# EAGLE design LB_BIT_1IN_3OUT-SMALL-v03(1_1x) (EAGLE 6.5.0)
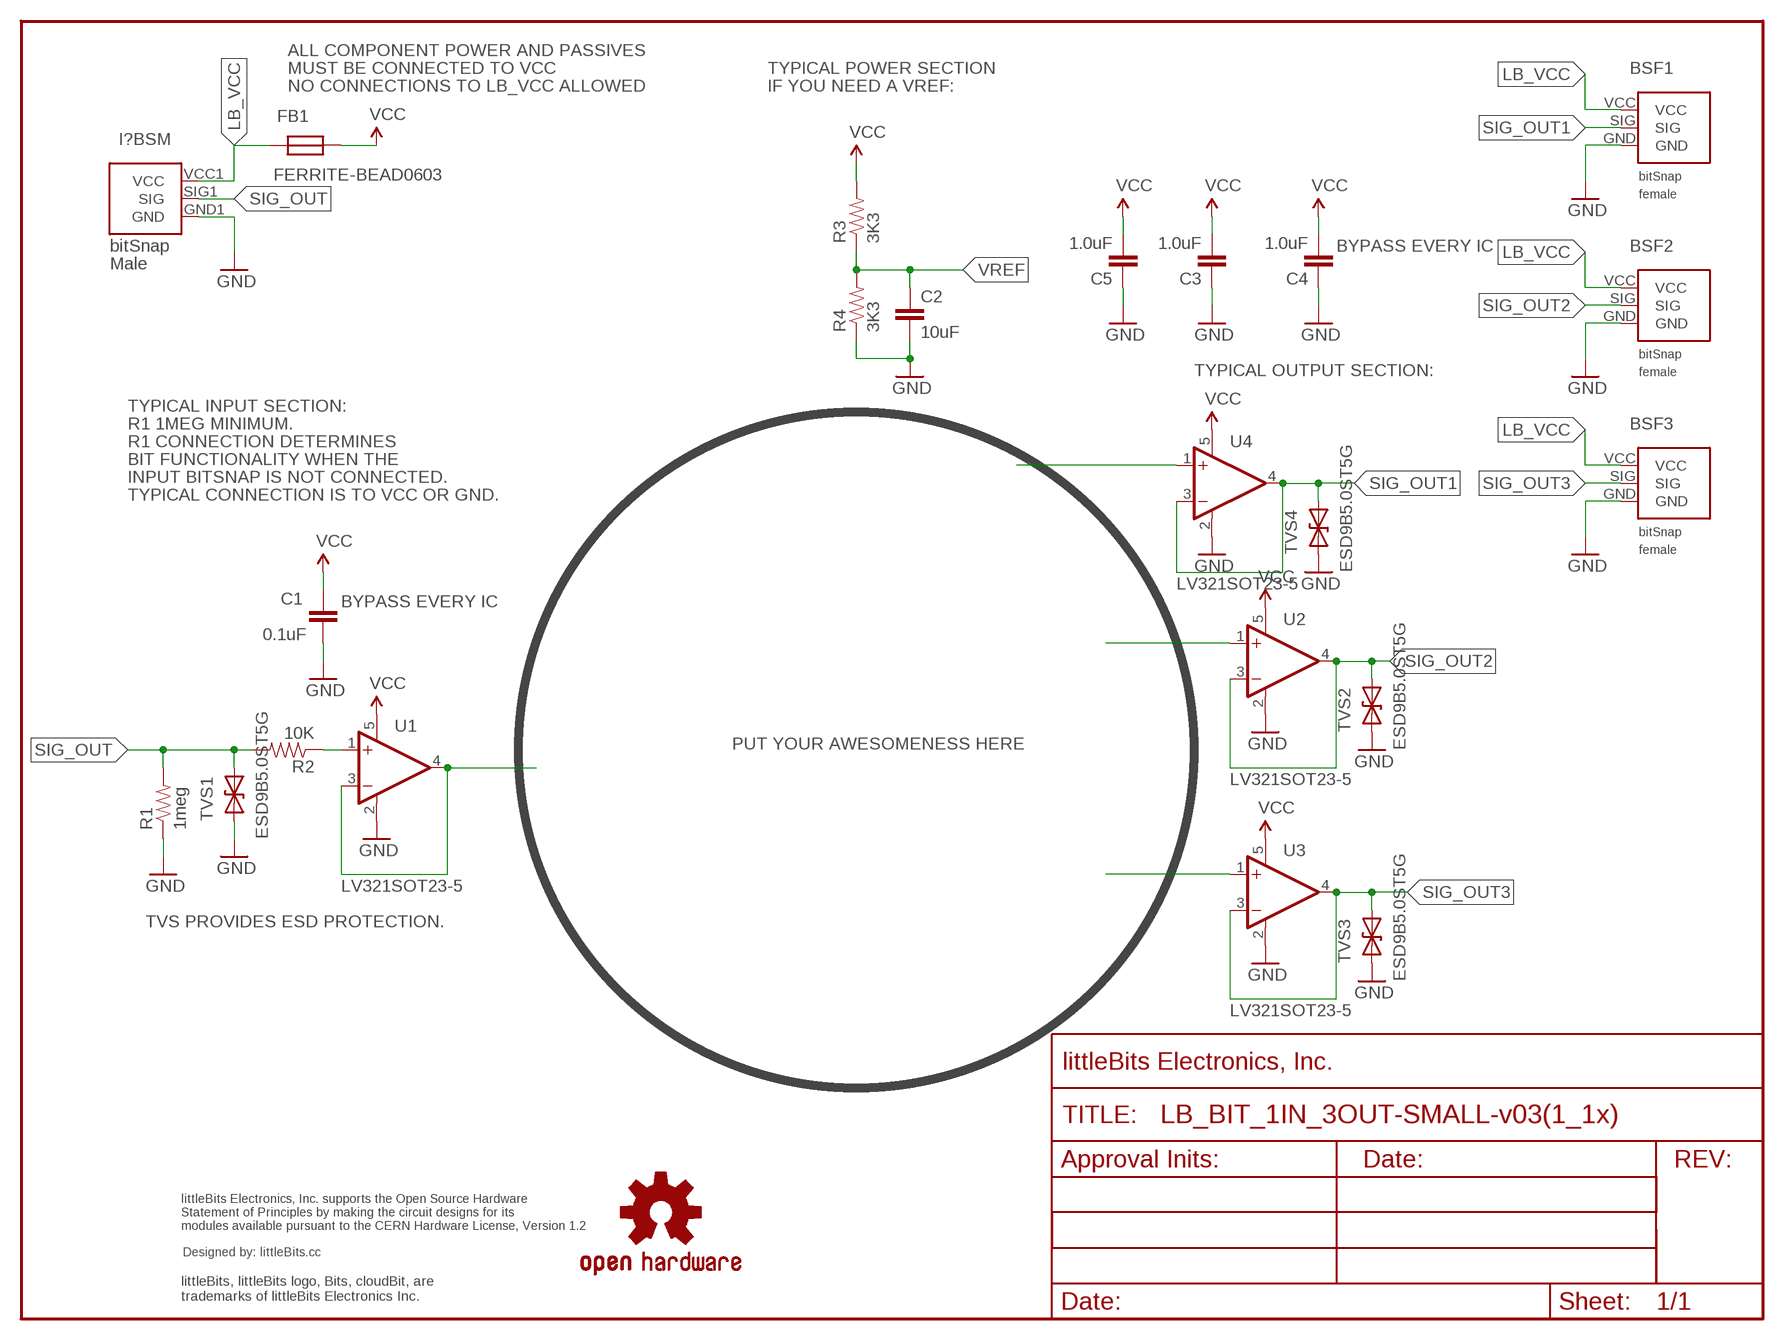
[diagram p0: schematic, sheet 1]

## Parts
BSF1  BITSNAP_V03_FEMALE  [BITSNAP_V03_FEMALE]
BSF2  BITSNAP_V03_FEMALE  [BITSNAP_V03_FEMALE]
BSF3  BITSNAP_V03_FEMALE  [BITSNAP_V03_FEMALE]
C1  0.1uF  CAPCAP-0603  [CAP-0603]
C2  10uF  CAPCAP-0603  [CAP-0603]
C3  1.0uF  CAPCAP-0603  [CAP-0603]
C4  1.0uF  CAPCAP-0603  [CAP-0603]
C5  1.0uF  CAPCAP-0603  [CAP-0603]
FB1  FERRITE-BEAD0603  [R0603]
FRAME1  FRAME-LETTER  [FABDWG01-OHW]
I?BSM  BITSNAP_V03_MALE  [BITSNAP_V03_MALE]
R1  1meg  RESISTOR0603  [RES-0603]
R2  10K  RESISTOR0603  [RES-0603]
R3  3K3  RESISTOR0603  [RES-0603]
R4  3K3  RESISTOR0603  [RES-0603]
TVS1  ESD9B5.0ST5G  DIODE-TVSSOD-923  [SOD-923]
TVS2  ESD9B5.0ST5G  DIODE-TVSSOD-923  [SOD-923]
TVS3  ESD9B5.0ST5G  DIODE-TVSSOD-923  [SOD-923]
TVS4  ESD9B5.0ST5G  DIODE-TVSSOD-923  [SOD-923]
U1  LV321SOT23-5  [SOT23-5]
U2  LV321SOT23-5  [SOT23-5]
U3  LV321SOT23-5  [SOT23-5]
U4  LV321SOT23-5  [SOT23-5]
U$1  OSHWCREDIT  [OSHWCREDIT]
U$3  OSHW-LOGOL  [OSHW-LOGO-L]

## Nets
GND: BSF1.GND BSF2.GND BSF3.GND C1.2 C2.2 C3.1 C4.1 C5.1 I?BSM.GND1(GND) R1.1 R4.1 TVS1.1(A) TVS2.1(A) TVS3.1(A) TVS4.1(A) U1.2(V-) U2.2(V-) U3.2(V-) U4.2(V-)
LB_VCC: BSF1.VCC BSF2.VCC BSF3.VCC FB1.2 I?BSM.VCC1(VCC)
N$2: U2.1(+IN)
N$3: U1.3(-IN) U1.4(OUT)
N$4: R2.1 U1.1(+IN)
N$5: U3.1(+IN)
N$12: U4.1(+IN)
SIG_OUT: I?BSM.SIG1(SIG) R1.2 R2.2 TVS1.2(C)
SIG_OUT1: BSF1.SIG TVS4.2(C) U4.3(-IN) U4.4(OUT)
SIG_OUT2: BSF2.SIG TVS2.2(C) U2.3(-IN) U2.4(OUT)
SIG_OUT3: BSF3.SIG TVS3.2(C) U3.3(-IN) U3.4(OUT)
VCC: C1.1 C3.2 C4.2 C5.2 FB1.1 R3.2 U1.5(V+) U2.5(V+) U3.5(V+) U4.5(V+)
VREF: C2.1 R3.1 R4.2

## Notes on the sheet
- ALL COMPONENT POWER AND PASSIVES
- MUST BE CONNECTED TO VCC | TYPICAL POWER SECTION
- NO CONNECTIONS TO LB_VCC ALLOWED | IF YOU NEED A VREF:
- BYPASS EVERY IC
- TYPICAL OUTPUT SECTION:
- TYPICAL INPUT SECTION:
- R1 1MEG MINIMUM.
- R1 CONNECTION DETERMINES
- BIT FUNCTIONALITY WHEN THE
- INPUT BITSNAP IS NOT CONNECTED.
- TYPICAL CONNECTION IS TO VCC OR GND.
- BYPASS EVERY IC
- PUT YOUR AWESOMENESS HERE
- TVS PROVIDES ESD PROTECTION.

## Library data of the parts
BSF1-BSF3 = bitSnap:BITSNAP_V03_FEMALE
C1-C5 = LITTLEBITS:CAP
FB1 = LITTLEBITS:FERRITE-BEAD
FRAME1 = LITTLEBITS:FRAME-LETTER
I?BSM = bitSnap:BITSNAP_V03_MALE
R1-R4 = LITTLEBITS:RESISTOR
TVS1-TVS4 = LITTLEBITS:DIODE-TVS: Bidirectional Transient Voltage Suppression Diode: Device conducts in avalanche mode after reaching a part dependent voltage threshold. Used for limiting voltage spikes on ESD sensitive inputs and outputs.; IEC_ESD_PROT0: +/-18kV; LB_PN: ?; MPN: ESD9B5.0ST5G; V_CLAMP: ?; V_OPERATION: 5V
U1-U4 = LITTLEBITS:LV321
U$1 = LITTLEBITS:OSHWCREDIT
U$3 = LITTLEBITS131206:OSHW-LOGO: Open Source Hardware Logo This logo indicates the piece of hardware it is found on incorporates a OSHW license and/or adheres to the definition of open source hardware found here: http://freedomdefined.org/OSHW

## Board
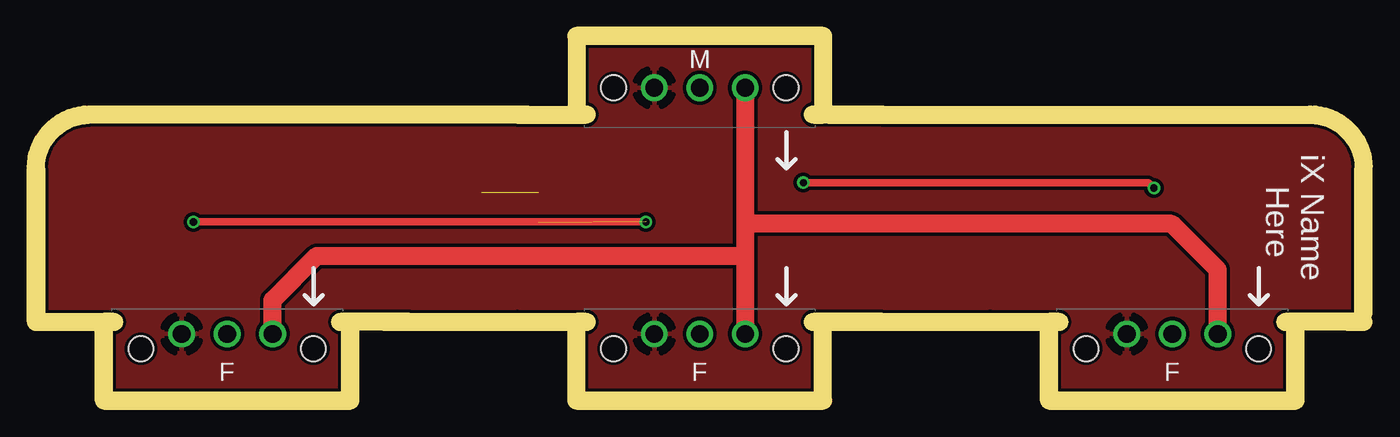
[diagram p1: board, top side]
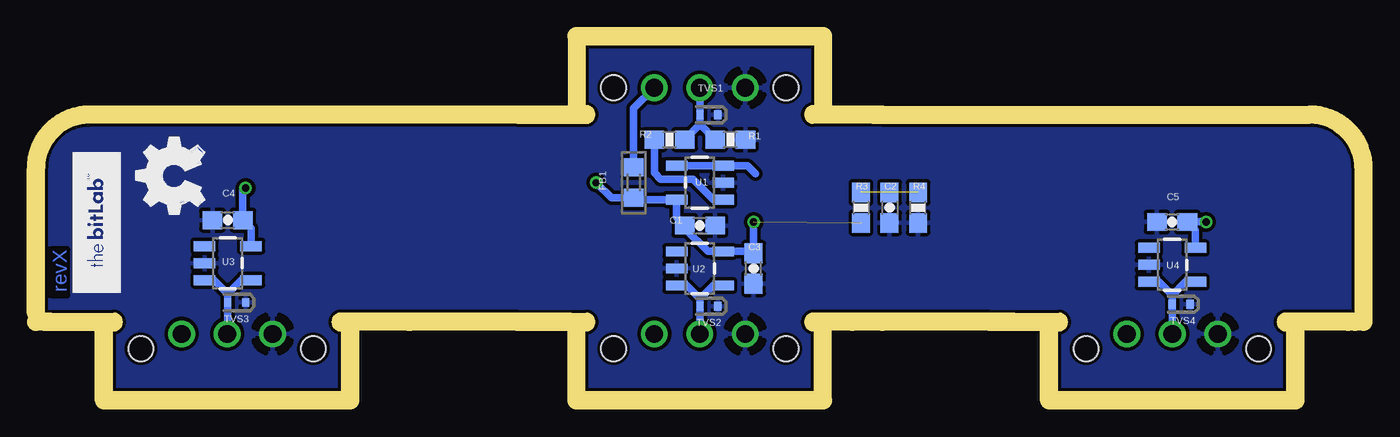
[diagram p2: board, bottom side, seen from below]

Size 73.24 x 19.39 mm. Coordinates in mm from the lower left corner, seen from the top.
Outline: 26.42,14.99 2.5,14.99 arc90 0,12.49 0,4.4
Outline: 46.82,14.99 70.75,14.99 arc-90 73.24,12.5 73.24,4.4
Outline: 20.42,4.4 26.42,4.4
Outline: 46.82,4.4 52.87,4.4
Copper layers (1*16): Top 0.035mm / dielectric 1.5mm / Bottom 0.035mm
Design rules "littleBitsDRC": minimum track width 0.2mm, minimum drill 0.2mm, track to track 0.2mm, track to pad 0.2mm, pad to pad 0.2mm, via to via 0.2mm, smd to smd 0mil, copper to edge 0.2mm, drill to drill 0.2mm, minimum pad ring 0.1mm, minimum via ring 0.15mm, stop-mask expansion 0.1mm, vias tented up to drill 0.5mm, thermal gap 0.2mm
Milling: 11 lines

### Footprints (pad centres in the part's own frame; a part is rotated, then mirrored left to right if it is on the bottom)
BITSNAP_V03_FEMALE = drill 1: GND 4.065,3.44; SIG 6.605,3.44; VCC 9.145,3.44 | hole 1.4: 1.785,2.61; 11.425,2.61
CAP-0603 = smd 1.1 x 1: 1 -0.85,0; 2 0.85,0
R0603 = smd 1 x 1.1: 1 -0.85,0; 2 0.85,0
BITSNAP_V03_MALE = drill 1: GND1 9.145,2.61; SIG1 6.605,2.61; VCC1 4.065,2.61 | hole 1.4: 1.785,2.61; 11.425,2.61
RES-0603 = smd 1.1 x 1: 1 -0.85,0; 2 0.85,0
SOD-923 = smd 0.4 x 0.5: 1 -0.5,0; 2 0.5,0
SOT23-5 = smd 0.55 x 1.2: 1 -0.95,-1.3; 2 0,-1.3; 3 0.95,-1.3; 4 0.95,1.3; 5 -0.95,1.3

### Placement (x,y rotation side)
BSF1  3.59,-0.21 0 top
BSF2  30.02,-0.21 0 top
BSF3  56.44,-0.21 0 top
C1  36.61,9.29 0 bottom
C2  26.01,10.29 270 bottom
C3  33.61,6.89 90 bottom
C4  63.01,9.59 0 bottom
C5  10.21,9.49 0 bottom
FB1  40.31,11.69 90 bottom
FRAME1  23.41,-0.21 0 top
I?BSM  43.23,19.61 180 top
R1  34.91,14.09 180 bottom
R2  38.31,14.09 0 bottom
R3  27.61,10.29 270 bottom
R4  24.41,10.29 90 bottom
TVS1  36.11,15.49 180 bottom
TVS2  36.11,4.79 180 bottom
TVS3  62.51,4.99 180 bottom
TVS4  9.71,4.89 180 bottom
U1  36.61,11.69 90 bottom
U2  36.61,6.89 270 bottom
U3  63.01,7.19 270 bottom
U4  10.21,7.09 270 bottom
U$1  -64.86,-63.26 0 top  (outside the outline)
U$2  [BITLAB-LOGO]  68.99,13.39 270 top
U$3  -1.12,-66.56 0 top  (outside the outline)
U$8  [OSHW_FILLX150_NOTEXT]  64.32,9.12 0 top

### Tracks (layer width: path | path; a pad name or v marks a point on that pad's centre or on a via)
GND
  pour Top: -0.49,19.49 73.71,19.49 73.71,-0.31 -0.49,-0.31
  pour Bottom: -0.49,19.49 -0.49,-0.31 73.71,-0.31 73.71,19.49
LB_VCC
  Top 1: I?BSM.VCC1 39.16,9.39 | 39.16,9.39 39.16,7.59 | 39.16,7.59 BSF2.VCC | BSF3.VCC 65.58,6.82 63.01,9.39 39.16,9.39 | BSF1.VCC 12.74,5.12 15.21,7.59 39.16,7.59
  Bottom 0.406: I?BSM.VCC1 40.31,15.84 FB1.2
N$3
  Bottom 0.406: U1.4 U1.3 33.96,12.64 33.51,12.19
N$4
  Bottom 0.406: R2.1 39.16,12.24 38.81,11.89 37.01,11.89 35.86,10.74 U1.1
SIG_OUT
  Bottom 0.406: I?BSM.SIG1 TVS1.2 36.61,14.94 | 36.61,14.94 R2.2 | R1.2 36.61,14.94
SIG_OUT1
  Bottom 0.406: U4.4 9.46,6.14 10.21,5.39 | 10.21,5.39 TVS4.2 BSF1.SIG | U4.3 10.96,6.14 10.21,5.39
SIG_OUT2
  Bottom 0.406: U2.4 35.86,5.94 36.61,5.19 | 36.61,5.19 TVS2.2 BSF2.SIG | 36.61,5.19 37.36,5.94 U2.3
SIG_OUT3
  Bottom 0.406: U3.4 62.26,6.24 63.01,5.49 | 63.01,5.49 TVS3.2 63.01,3.26 BSF3.SIG | U3.3 63.76,6.24 63.01,5.49
VCC  (via drill 0.4)  (1 unrouted)
  Top 0.406: v33.61,9.49 v8.31,9.49 | v42.41,11.69 61.71,11.69 v62.01,11.39
  Bottom 0.406: U3.5 61.71,9.14 C4.2 62.16,11.24 v62.01,11.39 | U4.5 8.91,9.04 C5.2 v8.31,9.49 | v33.61,9.49 C3.2 33.71,7.84 U2.5 36.16,7.84 37.46,9.14 C1.1 37.91,9.74 U1.5 40.21,10.74 FB1.1 41.56,10.84 v42.41,11.69
VREF  (2 unrouted)

### Text on the board
Bottom: revX
tPlace: iX Name / Here
Milling: 1mm DIA. ROUTER PATH
Measures: C.L.